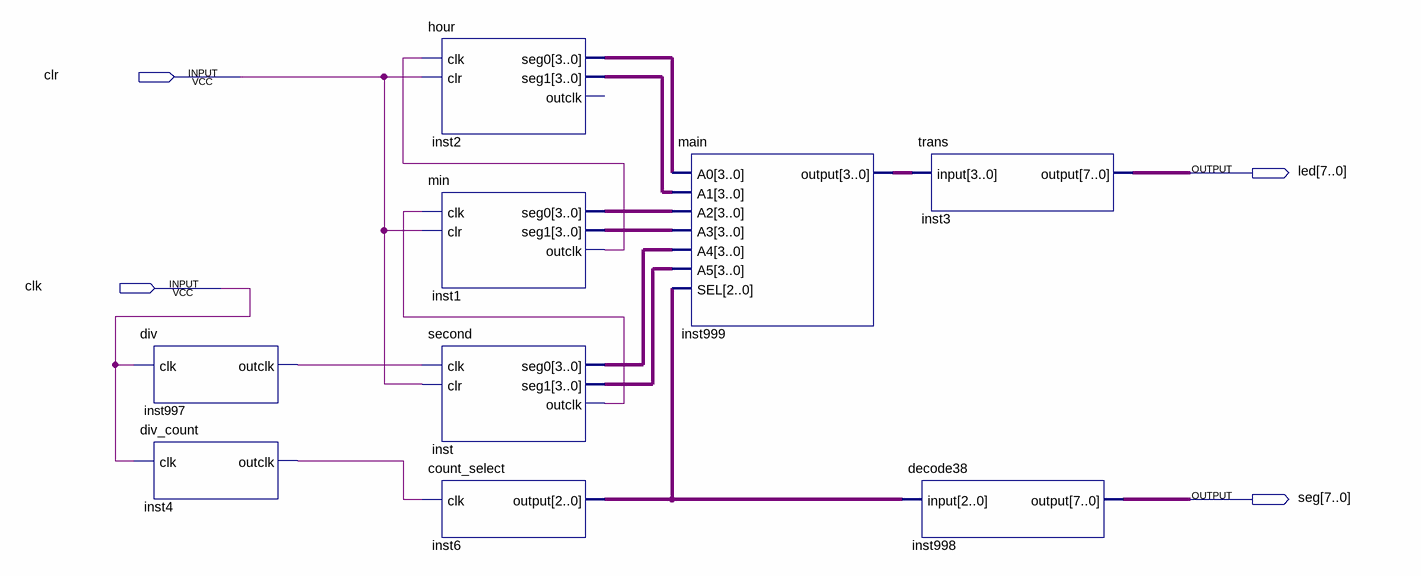
[diagram p0: schematic sheet]
// Quartus schematic clock.bdf as structural Verilog: 9 symbols, 4 pins
module clock (
  input  clr,
  input  clk,
  output [7:0] led,
  output [7:0] seg
);

  wire inst1_outclk, inst4_outclk, inst997_outclk, inst_outclk;
  wire [2:0] inst6_output;
  wire [3:0] inst1_seg0, inst1_seg1, inst2_seg0, inst2_seg1, inst999_output, inst_seg0, inst_seg1;

  div inst997 (.clk(clk), .outclk(inst997_outclk));
  div_count inst4 (.clk(clk), .outclk(inst4_outclk));
  hour inst2 (.clk(inst1_outclk), .clr(clr), .seg0(inst2_seg0), .seg1(inst2_seg1));  // open: outclk
  min inst1 (.clk(inst_outclk), .clr(clr), .seg0(inst1_seg0), .seg1(inst1_seg1), .outclk(inst1_outclk));
  second inst (.clk(inst997_outclk), .clr(clr), .seg0(inst_seg0), .seg1(inst_seg1), .outclk(inst_outclk));
  count_select inst6 (.clk(inst4_outclk), .\output (inst6_output));
  main inst999 (
    .A0(inst2_seg0), .A1(inst2_seg1), .A2(inst1_seg0), .A3(inst1_seg1), .A4(inst_seg0), .A5(inst_seg1),
    .SEL(inst6_output), .\output (inst999_output));
  decode38 inst998 (.\input (inst6_output), .\output (seg));
  trans inst3 (.\input (inst999_output), .\output (led));
endmodule
